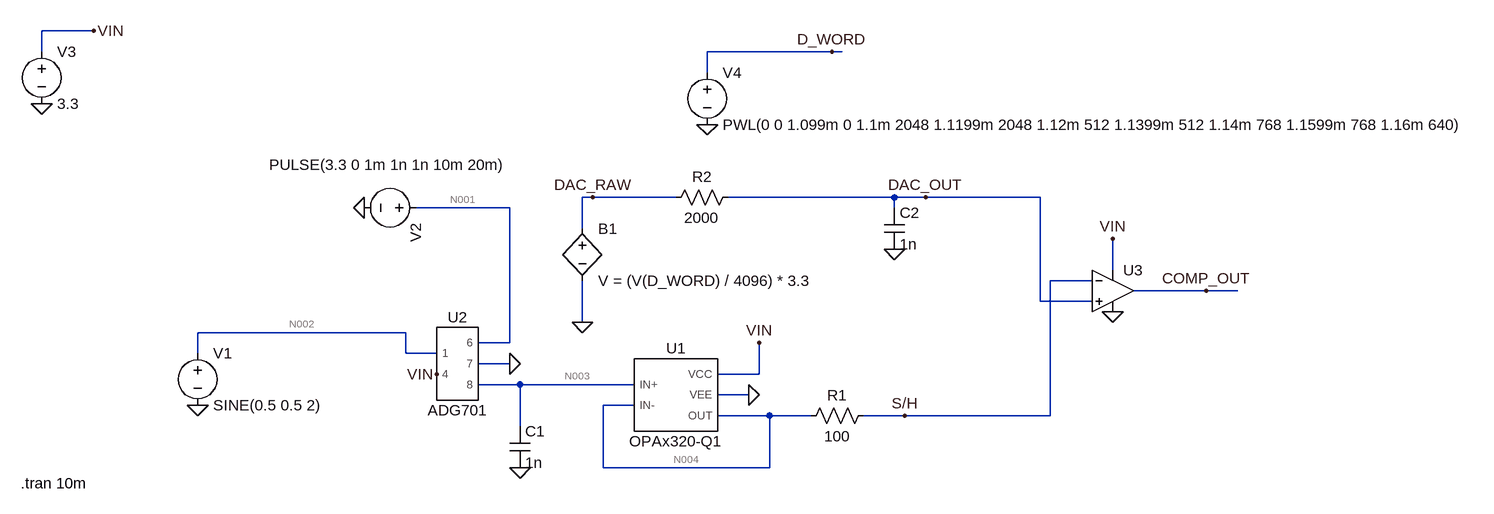
[diagram p0: schematic OTS_SAR_ADC_SIM.asc]
OTS_SAR_ADC_SIM.asc, the LTspice schematic file:
Version 4.1
SHEET 1 2212 680
WIRE 0 -400 -80 -400
WIRE -80 -368 -80 -400
WIRE 1136 -368 944 -368
WIRE 1152 -368 1136 -368
WIRE 944 -336 944 -368
WIRE 768 -144 752 -144
WIRE 896 -144 768 -144
WIRE 1232 -144 976 -144
WIRE 1280 -144 1232 -144
WIRE 1456 -144 1280 -144
WIRE 640 -128 496 -128
WIRE 1232 -128 1232 -144
WIRE 752 -96 752 -144
WIRE 1568 -32 1568 -80
WIRE 1536 -16 1472 -16
WIRE 1712 0 1600 0
WIRE 1760 0 1712 0
WIRE 1456 16 1456 -144
WIRE 1536 16 1456 16
WIRE 752 48 752 -16
WIRE 480 64 160 64
WIRE 640 80 640 -128
WIRE 640 80 592 80
WIRE 160 96 160 64
WIRE 480 96 480 64
WIRE 528 96 480 96
WIRE 640 112 592 112
WIRE 1024 128 1024 80
WIRE 1024 128 960 128
WIRE 656 144 592 144
WIRE 832 144 656 144
WIRE 1008 160 960 160
WIRE 832 176 784 176
WIRE 1040 192 960 192
WIRE 1104 192 1040 192
WIRE 1248 192 1184 192
WIRE 1472 192 1472 -16
WIRE 1472 192 1248 192
WIRE 656 208 656 144
WIRE 784 272 784 176
WIRE 1040 272 1040 192
WIRE 1040 272 784 272
FLAG 160 176 0
FLAG 416 -128 0
FLAG -80 -288 0
FLAG 0 -400 VIN
FLAG 528 128 VIN
FLAG 656 272 0
FLAG 1248 192 S/H
FLAG 1008 160 0
FLAG 1024 80 VIN
FLAG 640 112 0
FLAG 752 48 0
FLAG 768 -144 DAC_RAW
FLAG 1232 -64 0
FLAG 1280 -144 DAC_OUT
FLAG 1568 32 0
FLAG 1568 -80 VIN
FLAG 1712 0 COMP_OUT
FLAG 944 -256 0
FLAG 1136 -368 D_WORD
SYMBOL OPAx320-Q1 896 160 R0
SYMATTR InstName U1
SYMBOL ADG701 560 112 R0
SYMATTR InstName U2
SYMBOL bv 752 -112 R0
SYMATTR InstName B1
SYMATTR Value V = (V(D_WORD) / 4096) * 3.3
SYMBOL voltage 160 80 R0
WINDOW 123 0 0 Left 0
WINDOW 39 0 0 Left 0
SYMATTR InstName V1
SYMATTR Value SINE(0.5 0.5 2)
SYMBOL voltage 512 -128 R90
WINDOW 3 -66 -123 VRight 2
WINDOW 123 0 0 Left 0
WINDOW 39 0 0 Left 0
SYMATTR InstName V2
SYMATTR Value PULSE(3.3 0 1m 1n 1n 10m 20m)
SYMBOL voltage -80 -384 R0
SYMATTR InstName V3
SYMATTR Value 3.3
SYMBOL cap 640 208 R0
SYMATTR InstName C1
SYMATTR Value 1n
SYMBOL res 1200 176 R90
WINDOW 0 0 56 VBottom 2
WINDOW 3 32 56 VTop 2
SYMATTR InstName R1
SYMATTR Value 100
SYMBOL res 992 -160 R90
WINDOW 0 0 56 VBottom 2
WINDOW 3 32 56 VTop 2
SYMATTR InstName R2
SYMATTR Value 2000
SYMBOL cap 1216 -128 R0
SYMATTR InstName C2
SYMATTR Value 1n
SYMBOL OpAmps\\UniversalOpAmp2 1568 0 R0
SYMATTR InstName U3
SYMBOL voltage 944 -352 R0
WINDOW 123 0 0 Left 0
WINDOW 39 0 0 Left 0
SYMATTR InstName V4
SYMATTR Value PWL(0 0 1.099m 0 1.1m 2048 1.1199m 2048 1.12m 512 1.1399m 512 1.14m 768 1.1599m 768 1.16m 640)
TEXT -112 296 Left 2 !.tran 10m

The netlist it stands for:
* OTS_SAR_ADC_SIM.asc
X§U1 N003 N004 VIN 0 N004 OPAx320-Q1  ; pins IN+ IN- VCC VEE OUT
X§U2 N002 VIN N001 0 N003 ADG701  ; pins 1 4 6 7 8
B1 DAC_RAW 0 V = (V(D_WORD) / 4096) * 3.3
V1 N002 0 SINE(0.5 0.5 2)
V2 N001 0 PULSE(3.3 0 1m 1n 1n 10m 20m)
V3 VIN 0 3.3
C1 N003 0 1n
R1 S/H N004 100
R2 DAC_OUT DAC_RAW 2000
C2 DAC_OUT 0 1n
X§U3 DAC_OUT S/H VIN 0 COMP_OUT level2 Avol=1Meg GBW=10Meg Slew=10Meg Ilimit=25m Rail=0 Vos=0 En=0 Enk=0 In=0 Ink=0 Rin=500Meg  ; pins In+ In- V+ V- OUT
V4 D_WORD 0 PWL(0 0 1.099m 0 1.1m 2048 1.1199m 2048 1.12m 512 1.1399m 512 1.14m 768 1.1599m 768 1.16m 640)
.tran 10m
.lib OPAx320-Q1.LIB
.lib ADG701.cir
.lib UniversalOpAmp2.lib
.backanno
.end

* Results of the author's LTspice run, read from the files saved beside the schematic
* Operating Point, zero values left out:
*   V(comp_out) = 3.54 µV
*   V(dac_out) = 6.6 µV
*   V(n001) = 3.3 V
*   V(n002) = 500 mV
*   V(n003) = 500 mV
*   V(n004) = 500 mV
*   V(s/h) = 500 mV
*   V(vin) = 3.3 V
*   I(B1) = 3.3 nA
*   I(R1) = 2.3 nA
*   I(R2) = 3.3 nA
*   I(V1) = 10.06 pA
*   I(V3) = -1.45 mA
*   Ix(u1:in+) = -5.507 pA
*   Ix(u1:in-) = -5.751 pA
*   Ix(u1:out) = 2.306 nA
*   Ix(u1:vcc) = 1.45 mA
*   Ix(u1:vee) = -1.45 mA
*   Ix(u2:1) = -10.07 pA
*   Ix(u2:4) = 1.006 nA
*   Ix(u2:7) = -1.001 nA
*   Ix(u2:8) = 5.583 pA
*   Ix(u3:1) = -3.3 nA
*   Ix(u3:2) = -2.3 nA
*   Ix(u3:3) = 427 nA
*   Ix(u3:4) = -279.8 nA
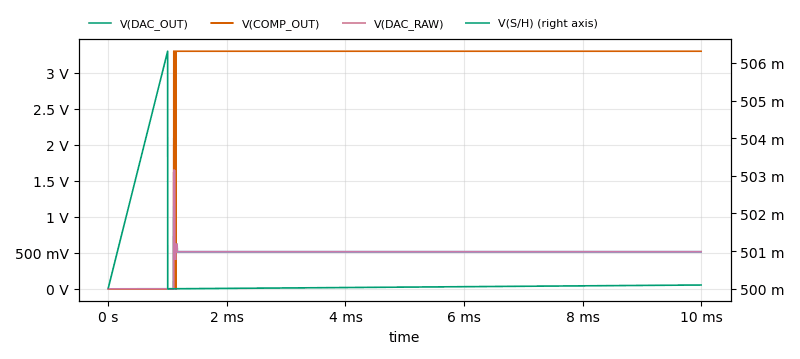
[diagram p1: Transient Analysis of OTS_SAR_ADC_SIM.asc, plotted from the saved traces]
* Transient Analysis, 1 run:
*   V(DAC_OUT): min 6.6 µV, max 1.65 V, average 461.2 mV, rms 491.1 mV, last 515.6 mV
*   V(COMP_OUT): min 2.655 µV, max 3.3 V, average 2.931 V, rms 3.11 V, last 3.3 V
*   V(S/H): min 500 m, max 506.3 m, average 500.4 m, rms 500.4 m, last 500.1 m
*   V(DAC_RAW): min 0 V, max 1.65 V, average 461.3 mV, rms 491.6 mV, last 515.6 mV